# Altium schematic sheet Top.SchDoc
size A3; DocumentNumber: 2; Revision: B; SheetNumber: 2; SheetTotal: 7; SheetTitle: Top Level Design; Designer: DM; Reviewer: -; PageSetup: Record=PageOptions|CenterHorizontal=True|CenterVertical=True|PrintScale=1.04|XCorrection=1.00|YCorrection=1.00|PrintKind=0|BorderSize=5000000|LeftOffset=0|BottomOffset=0|Orientation=2|PaperLength=1000|PaperWidth=1000|Scale=100|PaperSource=7|PrintQuality=-3|MediaType=1|DitherType=10|PrintScaleMode=1|PaperKind=A3 297 x 420 mm|PaperIndex=8
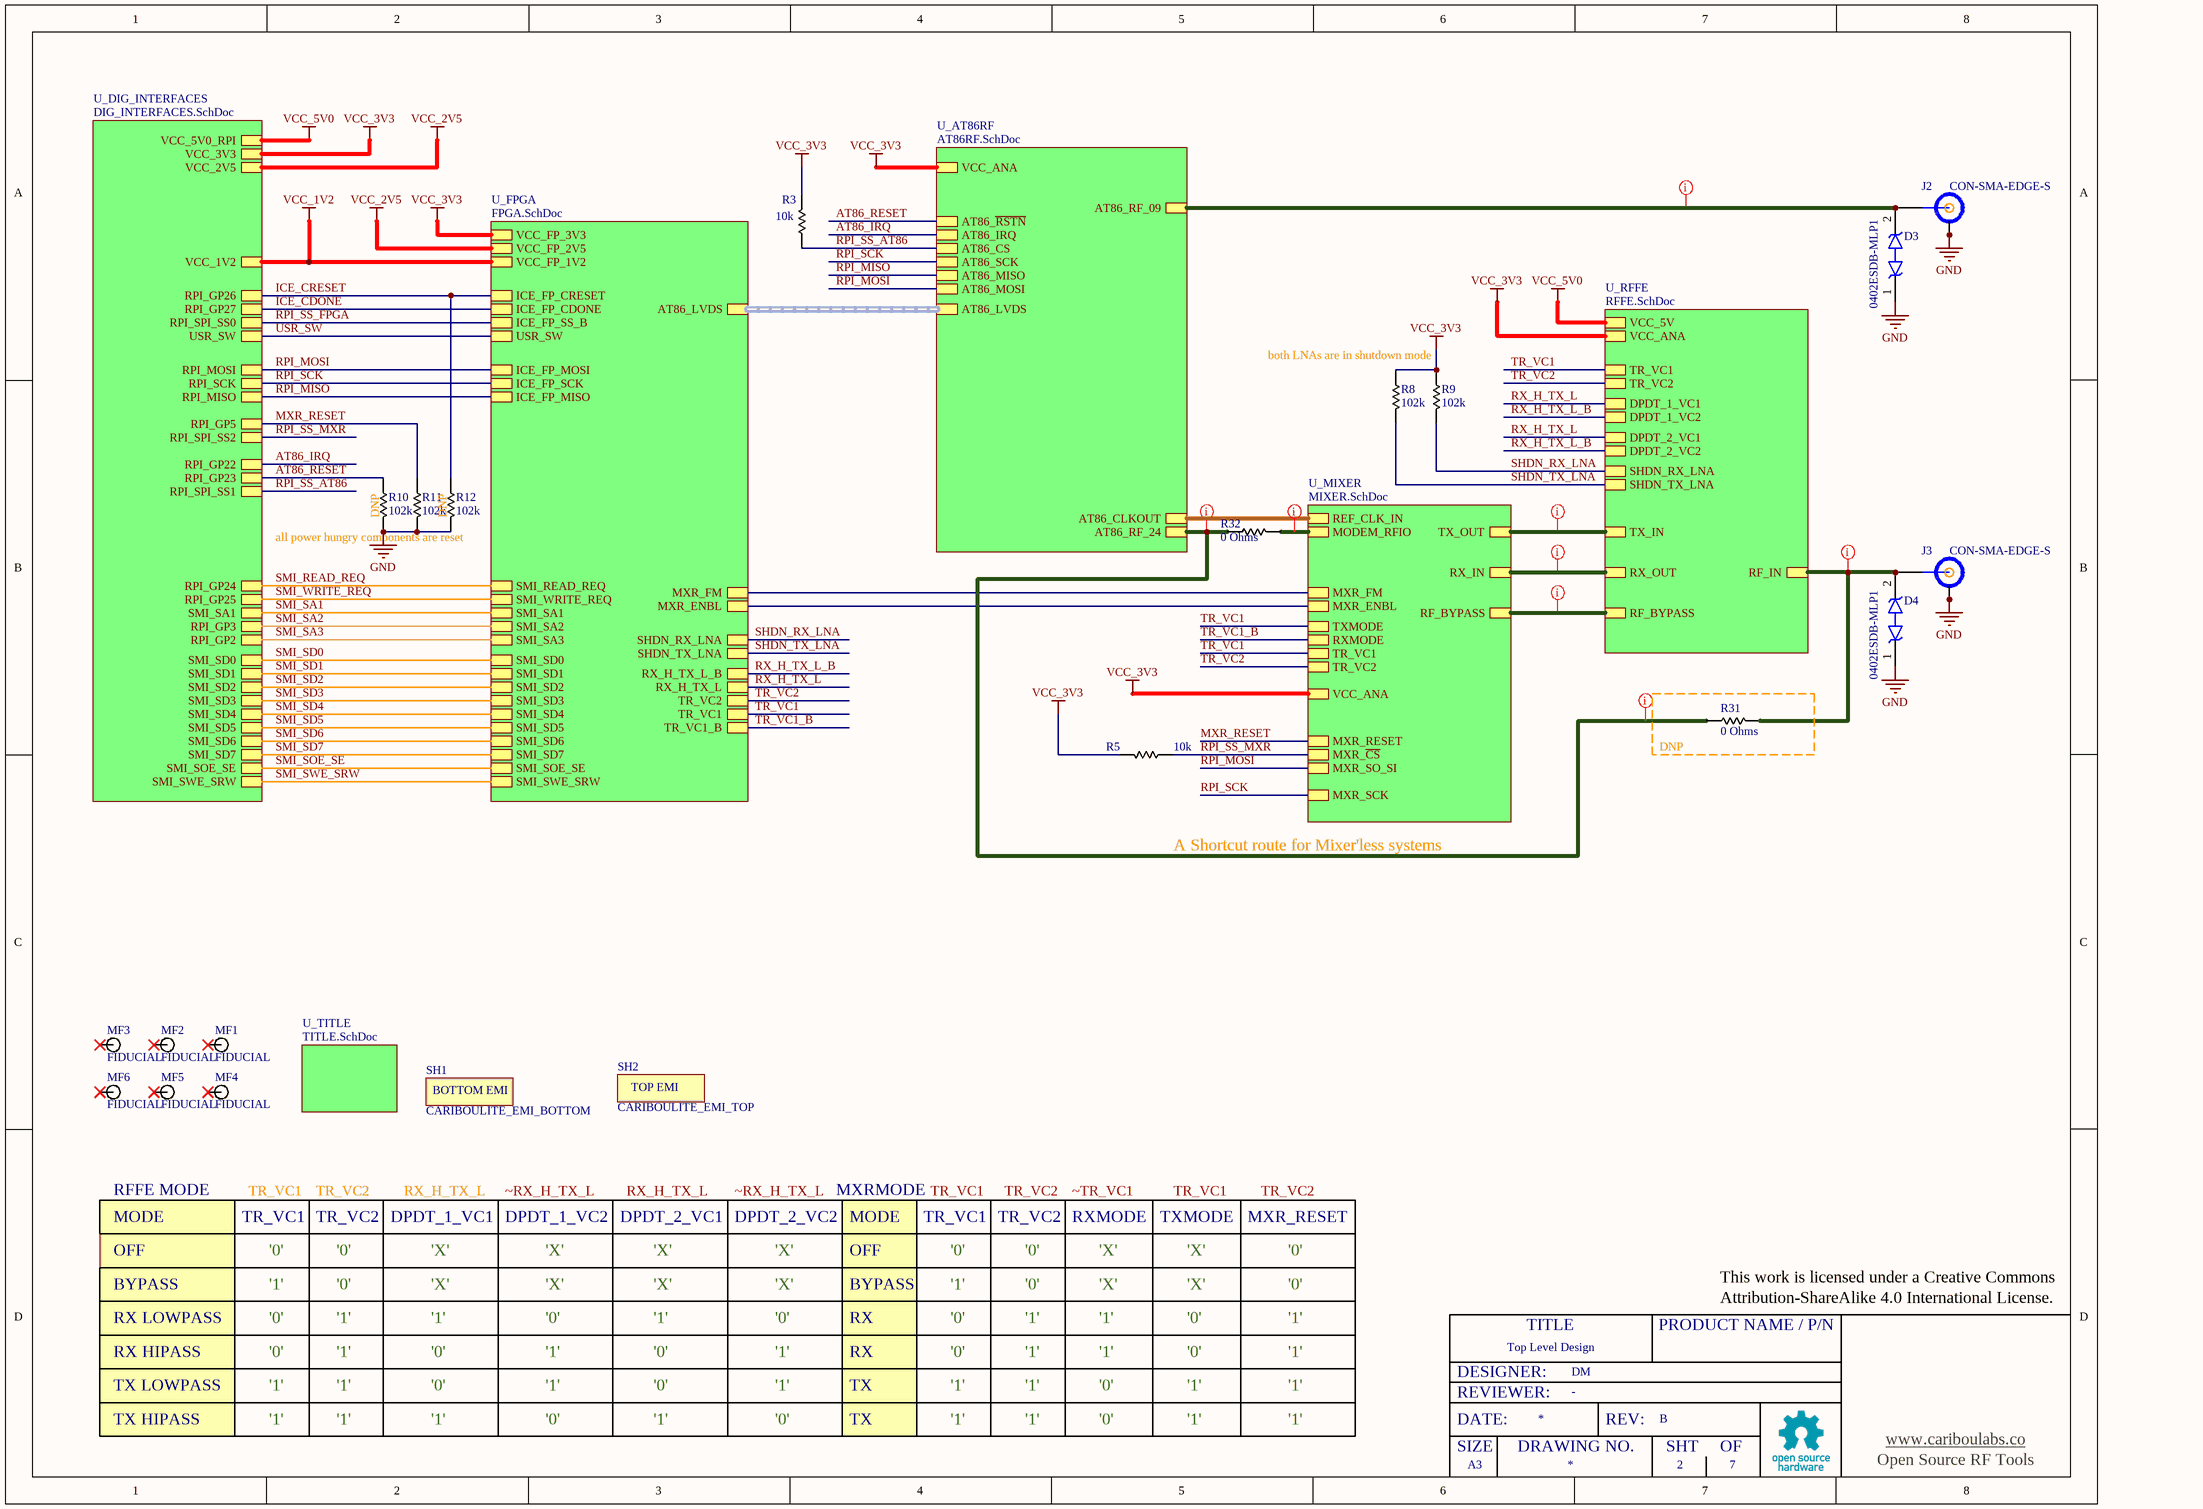
[diagram p0: Top.SchDoc]

## Parts
D3  0402ESDB-MLP1  [DIONC1105X44N]
D4  0402ESDB-MLP1  [DIONC1105X44N]
J2  CON-SMA-EDGE-S  [MOLEX_0732511150]
J3  CON-SMA-EDGE-S  [MOLEX_0732511150]
MF1  FIDUCIAL  [FIDUCIAL_1_0_MM]  (net tie, no BOM)
MF2  FIDUCIAL  [FIDUCIAL_1_0_MM]  (net tie, no BOM)
MF3  FIDUCIAL  [FIDUCIAL_1_0_MM]  (net tie, no BOM)
MF4  FIDUCIAL  [FIDUCIAL_1_0_MM]  (net tie, no BOM)
MF5  FIDUCIAL  [FIDUCIAL_1_0_MM]  (net tie, no BOM)
MF6  FIDUCIAL  [FIDUCIAL_1_0_MM]  (net tie, no BOM)
R3  10k  [PANASONIC 0402]
R5  10k  [PANASONIC 0402]
R8  102k  [PANASONIC 0402]
R9  102k  [PANASONIC 0402]
R10  102k  [PANASONIC 0402]
R11  102k  [PANASONIC 0402]
R12  102k  [PANASONIC 0402]
R31  0 Ohms  [PANASONIC 0402]
R32  0 Ohms  [PANASONIC 0402]
SH1  CARIBOULITE_EMI_BOTTOM  [CARIBOULITE_EMI_BOTTOM]  (no BOM)
SH2  CARIBOULITE_EMI_TOP  [CARIBOULITE_EMI_TOP]  (no BOM)

## Blocks framed on the sheet
DNP: R31

## Sub-sheets
U_AT86RF = AT86RF.SchDoc: AT86_CLKOUT, AT86_RF_24, AT86_RF_09, AT86_~{RSTN}, AT86_IRQ, AT86_CS, AT86_SCK, AT86_MISO, AT86_MOSI, VCC_ANA, AT86_LVDS (harness AT86_LVDS)
U_DIG_INTERFACES = DIG_INTERFACES.SchDoc: VCC_2V5, VCC_1V2, VCC_5V0_RPI, RPI_SPI_SS2, RPI_MOSI, RPI_SCK, RPI_MISO, RPI_GP27, RPI_SPI_SS0, RPI_SPI_SS1, RPI_GP22, VCC_3V3, RPI_GP23, USR_SW, SMI_SD5, SMI_SOE_SE, SMI_SD3, SMI_SD1, SMI_SD2, SMI_SA1, SMI_SD4, SMI_SWE_SRW, SMI_SD0, SMI_SD6, SMI_SD7, RPI_GP2, RPI_GP3, RPI_GP26, RPI_GP25, RPI_GP5, RPI_GP24
U_FPGA = FPGA.SchDoc: VCC_FP_1V2, VCC_FP_3V3, AT86_LVDS (harness AT86_LVDS), ICE_FP_CRESET, ICE_FP_CDONE, ICE_FP_SS_B, ICE_FP_MOSI, ICE_FP_SCK, ICE_FP_MISO, TR_VC1, RX_H_TX_L, TR_VC2, TR_VC1_B, RX_H_TX_L_B, SHDN_TX_LNA, SHDN_RX_LNA, USR_SW, MXR_FM, MXR_ENBL, SMI_SD5, SMI_SOE_SE, SMI_WRITE_REQ, SMI_SD3, SMI_SD1, SMI_SD2, SMI_SA1, SMI_SD4, SMI_SWE_SRW, SMI_SD0, SMI_SD6, SMI_SD7, SMI_SA2, SMI_SA3, VCC_FP_2V5, SMI_READ_REQ
U_MIXER = MIXER.SchDoc: VCC_ANA, MXR_~{CS}, MXR_SO_SI, MXR_SCK, REF_CLK_IN, MXR_RESET, TX_OUT, RX_IN, MODEM_RFIO, RXMODE, TXMODE, RF_BYPASS, TR_VC2, TR_VC1, MXR_FM, MXR_ENBL
U_RFFE = RFFE.SchDoc: VCC_ANA, RF_IN, TX_IN, RX_OUT, TR_VC1, TR_VC2, DPDT_1_VC1, DPDT_1_VC2, DPDT_2_VC1, DPDT_2_VC2, RF_BYPASS, SHDN_TX_LNA, SHDN_RX_LNA, VCC_5V
U_TITLE = TITLE.SchDoc: no entries

## Nets
GND: D3.1 D4.1 J2.2(OUTER) J2.3(OUTER) J2.4(OUTER) J2.5(OUTER) J2.6(OUTER) J2.7(OUTER) J3.2(OUTER) J3.3(OUTER) J3.4(OUTER) J3.5(OUTER) J3.6(OUTER) J3.7(OUTER) R10.2 R11.2 R12.2
VCC_1V2: sheet U_FPGA/VCC_FP_1V2, sheet U_DIG_INTERFACES/VCC_1V2
VCC_2V5: sheet U_FPGA/VCC_FP_2V5, sheet U_DIG_INTERFACES/VCC_2V5
VCC_3V3: R3.2 R5.2 R8.1 R9.1 ; sheet U_AT86RF/VCC_ANA, sheet U_FPGA/VCC_FP_3V3, sheet U_RFFE/VCC_ANA, sheet U_DIG_INTERFACES/VCC_3V3, sheet U_MIXER/VCC_ANA
VCC_5V0: sheet U_RFFE/VCC_5V, sheet U_DIG_INTERFACES/VCC_5V0_RPI
AT86_IRQ: sheet U_AT86RF/AT86_IRQ, sheet U_DIG_INTERFACES/RPI_GP22
AT86_RESET: R10.1 ; sheet U_AT86RF/AT86_~{RSTN}, sheet U_DIG_INTERFACES/RPI_GP23
ICE_CDONE: sheet U_FPGA/ICE_FP_CDONE, sheet U_DIG_INTERFACES/RPI_GP27
ICE_CRESET: R12.1 ; sheet U_FPGA/ICE_FP_CRESET, sheet U_DIG_INTERFACES/RPI_GP26
MXR_RESET: R11.1 ; sheet U_DIG_INTERFACES/RPI_GP5, sheet U_MIXER/MXR_RESET
RPI_MISO: sheet U_AT86RF/AT86_MISO, sheet U_FPGA/ICE_FP_MISO, sheet U_DIG_INTERFACES/RPI_MISO
RPI_MOSI: sheet U_AT86RF/AT86_MOSI, sheet U_FPGA/ICE_FP_MOSI, sheet U_DIG_INTERFACES/RPI_MOSI, sheet U_MIXER/MXR_SO_SI
RPI_SCK: sheet U_AT86RF/AT86_SCK, sheet U_FPGA/ICE_FP_SCK, sheet U_DIG_INTERFACES/RPI_SCK, sheet U_MIXER/MXR_SCK
RPI_SS_AT86: R3.1 ; sheet U_AT86RF/AT86_CS, sheet U_DIG_INTERFACES/RPI_SPI_SS1
RPI_SS_FPGA: sheet U_FPGA/ICE_FP_SS_B, sheet U_DIG_INTERFACES/RPI_SPI_SS0
RPI_SS_MXR: R5.1 ; sheet U_DIG_INTERFACES/RPI_SPI_SS2, sheet U_MIXER/MXR_~{CS}
RX_H_TX_L: sheet U_FPGA/RX_H_TX_L, sheet U_RFFE/DPDT_1_VC1, sheet U_RFFE/DPDT_2_VC1
RX_H_TX_L_B: sheet U_FPGA/RX_H_TX_L_B, sheet U_RFFE/DPDT_1_VC2, sheet U_RFFE/DPDT_2_VC2
SHDN_RX_LNA: R9.2 ; sheet U_FPGA/SHDN_RX_LNA, sheet U_RFFE/SHDN_RX_LNA
SHDN_TX_LNA: R8.2 ; sheet U_FPGA/SHDN_TX_LNA, sheet U_RFFE/SHDN_TX_LNA
SMI_READ_REQ: sheet U_FPGA/SMI_READ_REQ, sheet U_DIG_INTERFACES/RPI_GP24
SMI_SA1: sheet U_FPGA/SMI_SA1, sheet U_DIG_INTERFACES/SMI_SA1
SMI_SA2: sheet U_FPGA/SMI_SA2, sheet U_DIG_INTERFACES/RPI_GP3
SMI_SA3: sheet U_FPGA/SMI_SA3, sheet U_DIG_INTERFACES/RPI_GP2
SMI_SD0: sheet U_FPGA/SMI_SD0, sheet U_DIG_INTERFACES/SMI_SD0
SMI_SD1: sheet U_FPGA/SMI_SD1, sheet U_DIG_INTERFACES/SMI_SD1
SMI_SD2: sheet U_FPGA/SMI_SD2, sheet U_DIG_INTERFACES/SMI_SD2
SMI_SD3: sheet U_FPGA/SMI_SD3, sheet U_DIG_INTERFACES/SMI_SD3
SMI_SD4: sheet U_FPGA/SMI_SD4, sheet U_DIG_INTERFACES/SMI_SD4
SMI_SD5: sheet U_FPGA/SMI_SD5, sheet U_DIG_INTERFACES/SMI_SD5
SMI_SD6: sheet U_FPGA/SMI_SD6, sheet U_DIG_INTERFACES/SMI_SD6
SMI_SD7: sheet U_FPGA/SMI_SD7, sheet U_DIG_INTERFACES/SMI_SD7
SMI_SOE_SE: sheet U_FPGA/SMI_SOE_SE, sheet U_DIG_INTERFACES/SMI_SOE_SE
SMI_SWE_SRW: sheet U_FPGA/SMI_SWE_SRW, sheet U_DIG_INTERFACES/SMI_SWE_SRW
SMI_WRITE_REQ: sheet U_FPGA/SMI_WRITE_REQ, sheet U_DIG_INTERFACES/RPI_GP25
TR_VC1: sheet U_FPGA/TR_VC1, sheet U_RFFE/TR_VC1, sheet U_MIXER/TXMODE, sheet U_MIXER/TR_VC1
TR_VC1_B: sheet U_FPGA/TR_VC1_B, sheet U_MIXER/RXMODE
TR_VC2: sheet U_FPGA/TR_VC2, sheet U_RFFE/TR_VC2, sheet U_MIXER/TR_VC2
USR_SW: sheet U_FPGA/USR_SW, sheet U_DIG_INTERFACES/USR_SW
NetD3_2: D3.2 J2.1(INNER) ; sheet U_AT86RF/AT86_RF_09
NetD4_2: D4.2 J3.1(INNER) R31.2 ; sheet U_RFFE/RF_IN
NetR31_1: R31.1 R32.1 ; sheet U_AT86RF/AT86_RF_24
NetR32_2: R32.2 ; sheet U_MIXER/MODEM_RFIO
(unnamed): sheet U_AT86RF/AT86_CLKOUT, sheet U_MIXER/REF_CLK_IN
(unnamed): sheet U_FPGA/MXR_FM, sheet U_MIXER/MXR_FM
(unnamed): sheet U_FPGA/MXR_ENBL, sheet U_MIXER/MXR_ENBL
(unnamed): sheet U_RFFE/TX_IN, sheet U_MIXER/TX_OUT
(unnamed): sheet U_RFFE/RX_OUT, sheet U_MIXER/RX_IN
(unnamed): sheet U_RFFE/RF_BYPASS, sheet U_MIXER/RF_BYPASS

Not connected (* = marked no-connect by the designer): MF1 1; MF2 1; MF3 1; MF4 1; MF5 1; MF6 1

## Buses and harness runs
harness sheet U_AT86RF/AT86_LVDS = sheet U_FPGA/AT86_LVDS

## Layout directives
net class RF50OHM: (no net found under the mark), NetD3_2, NetD4_2, NetR31_1, NetR32_2

## Notes on the sheet
- both LNAs are in shutdown mode
- (near R10) DNP
- (near R12) DNP
- all power hungry components are reset
- A Shortcut route for Mixer'less systems
- MODE
- OFF
- RFFE MODE
- TR_VC1
- '0'
- TR_VC2
- DPDT_1_VC1
- RX_H_TX_L
- 'X'
- DPDT_1_VC2
- ~RX_H_TX_L
- DPDT_2_VC1
- DPDT_2_VC2
- MXRMODE
- RXMODE
- ~TR_VC1
- TXMODE
- MXR_RESET
- BYPASS
- RX LOWPASS
- '1'
- RX
- This work is licensed under a Creative Commons
- Attribution-ShareAlike 4.0 International License.
- RX HIPASS
- TX LOWPASS
- TX
- TX HIPASS
- DESIGNER:
- REVIEWER:
- TITLE
- PRODUCT NAME / P/N
- SIZE
- DATE:
- DRAWING NO.
- REV:
- SHT
- OF
- www.cariboulabs.co
- A3
- Open Source RF Tools
- (in symbol CARIBOULITE_EMI_BOTTOM) BOTTOM EMI
- (in symbol CARIBOULITE_EMI_TOP) TOP EMI

## Library data of the parts
D3 D4 = LXES15AAA1-153: ESD Suppressors / TVS Diodes ESD Protection Device, 0402, Bidirectional, 4V working, 15V breakdown, 0.05pF Cd; Manu. P/N: 0402ESDB-MLP1
J2 J3 = CON-SMA-EDGE-S: RF SMA Connectors / Coaxial Connectors SMA Female PCB Edge Mount; Manu. P/N: CON-SMA-EDGE-S
R3 R5 = Resistor: Thick Film Resistors - SMD 0402 1/16watt 10Kohms 1%; Manu. P/N: CRCW040210K0FKEDC; Power Rating: 62.5 mW (1/16 W); Temp. Ceoff.: 100 PPM/C; Tolerance: 1%; VALUE: 10k
R8-R12 = Resistor: Thick Film Resistors - SMD 102 kOhms 62.5mW 0402 1%; Manu. P/N: RC0402FR-07102KL; Power Rating: 62.5 mW (1/16 W); Temp. Ceoff.: 100 PPM / C; Tolerance: 1%; VALUE: 102k
R31 R32 = Resistor: 0 Ohms jumper resistor 0402; Manu. P/N: CRCW04020000Z0EDC; Power Rating: 62.5 mW (1/16 W); Temp. Ceoff.: 0 PPM/C; Tolerance: 1%; VALUE: 0 Ohms
MF1-MF6 = FIDUCIAL: MANU_PN: FIDUCIAL